# EAGLE design SC (EAGLE 9.4.0)
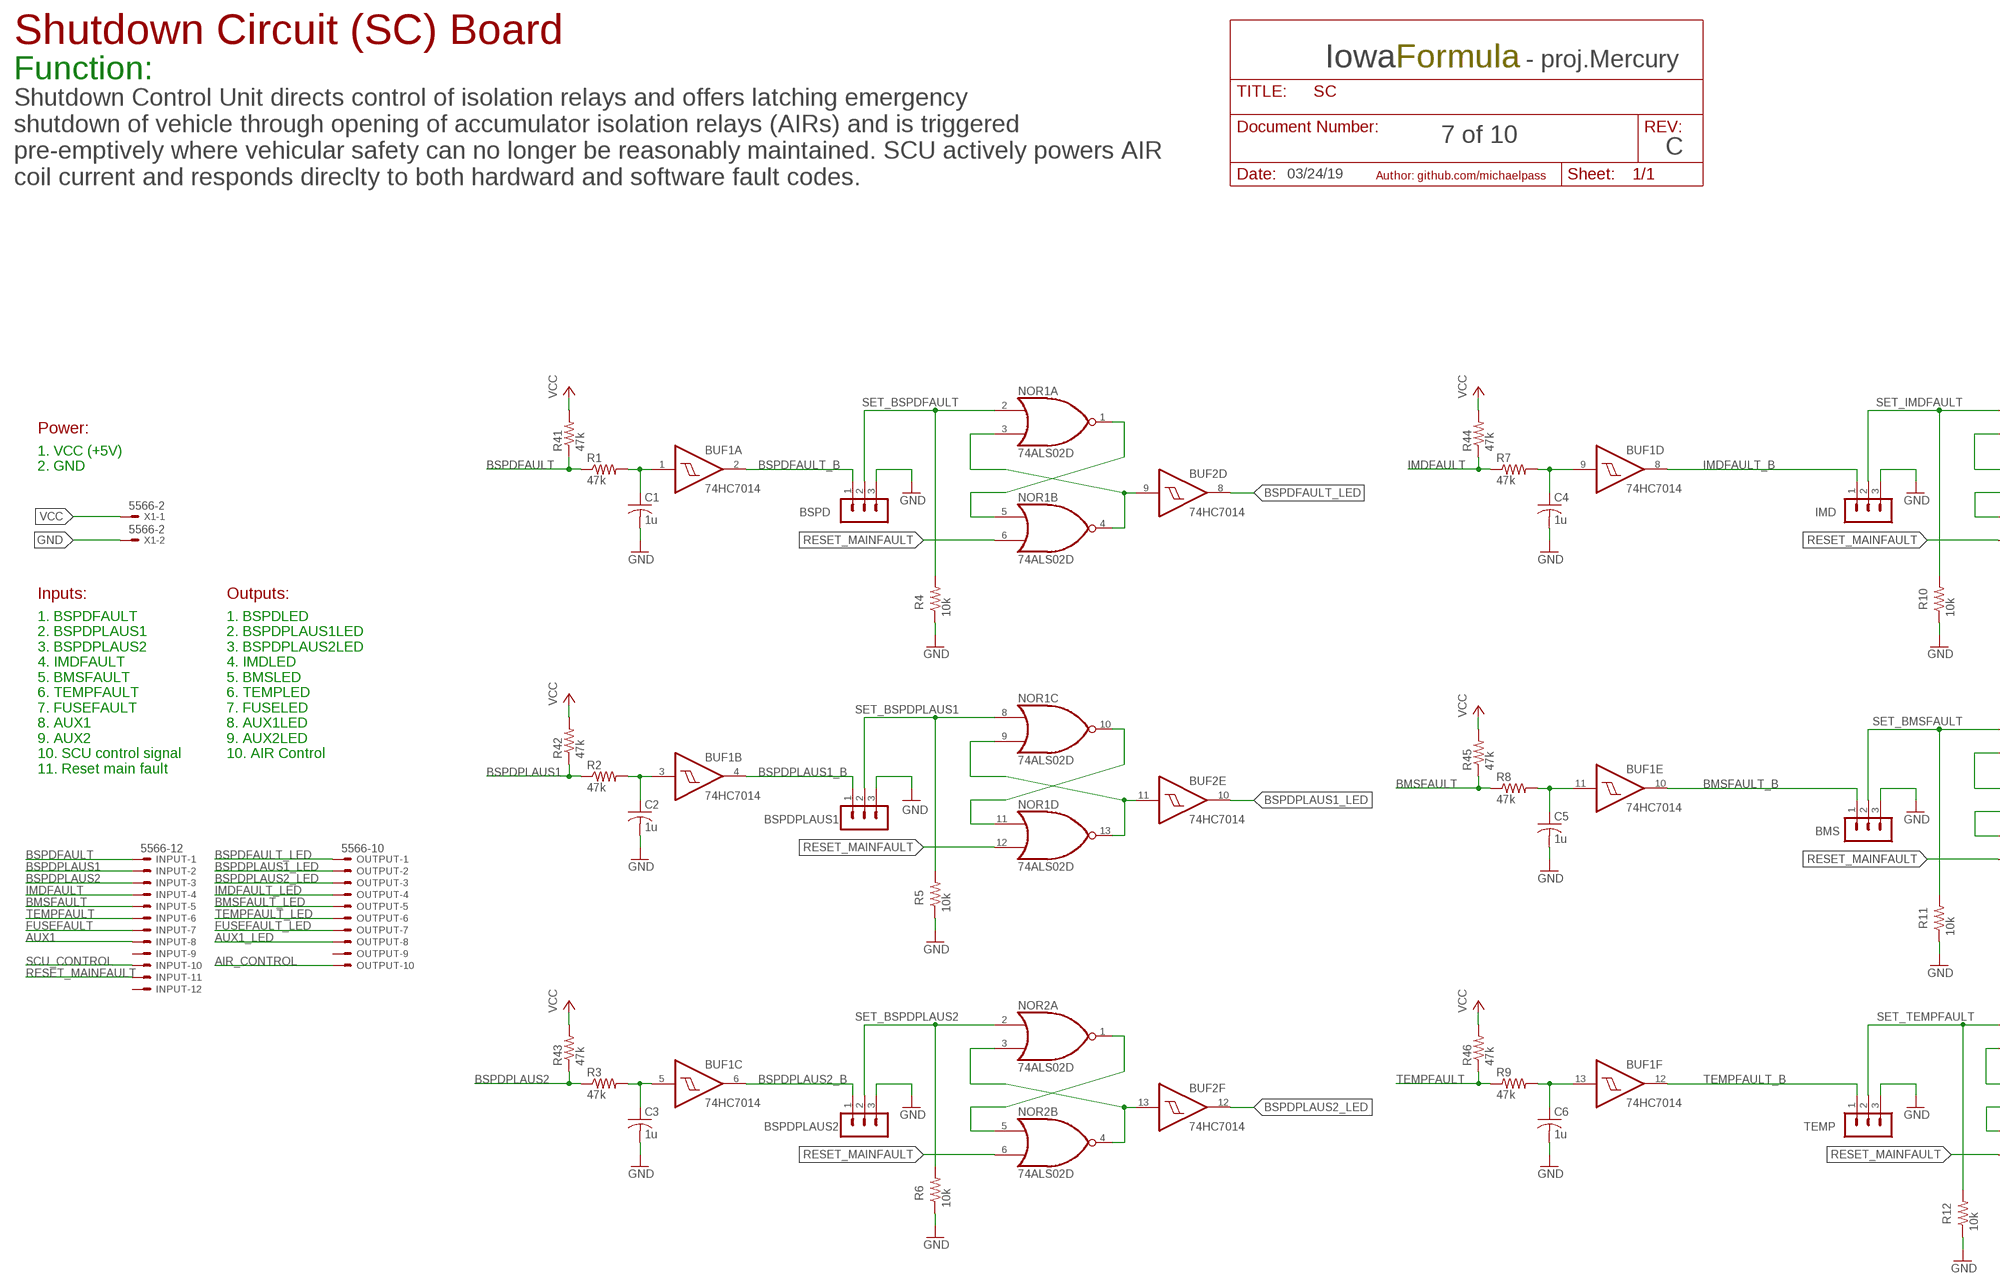
[diagram p0: schematic, sheet 1, part 1 of 3]
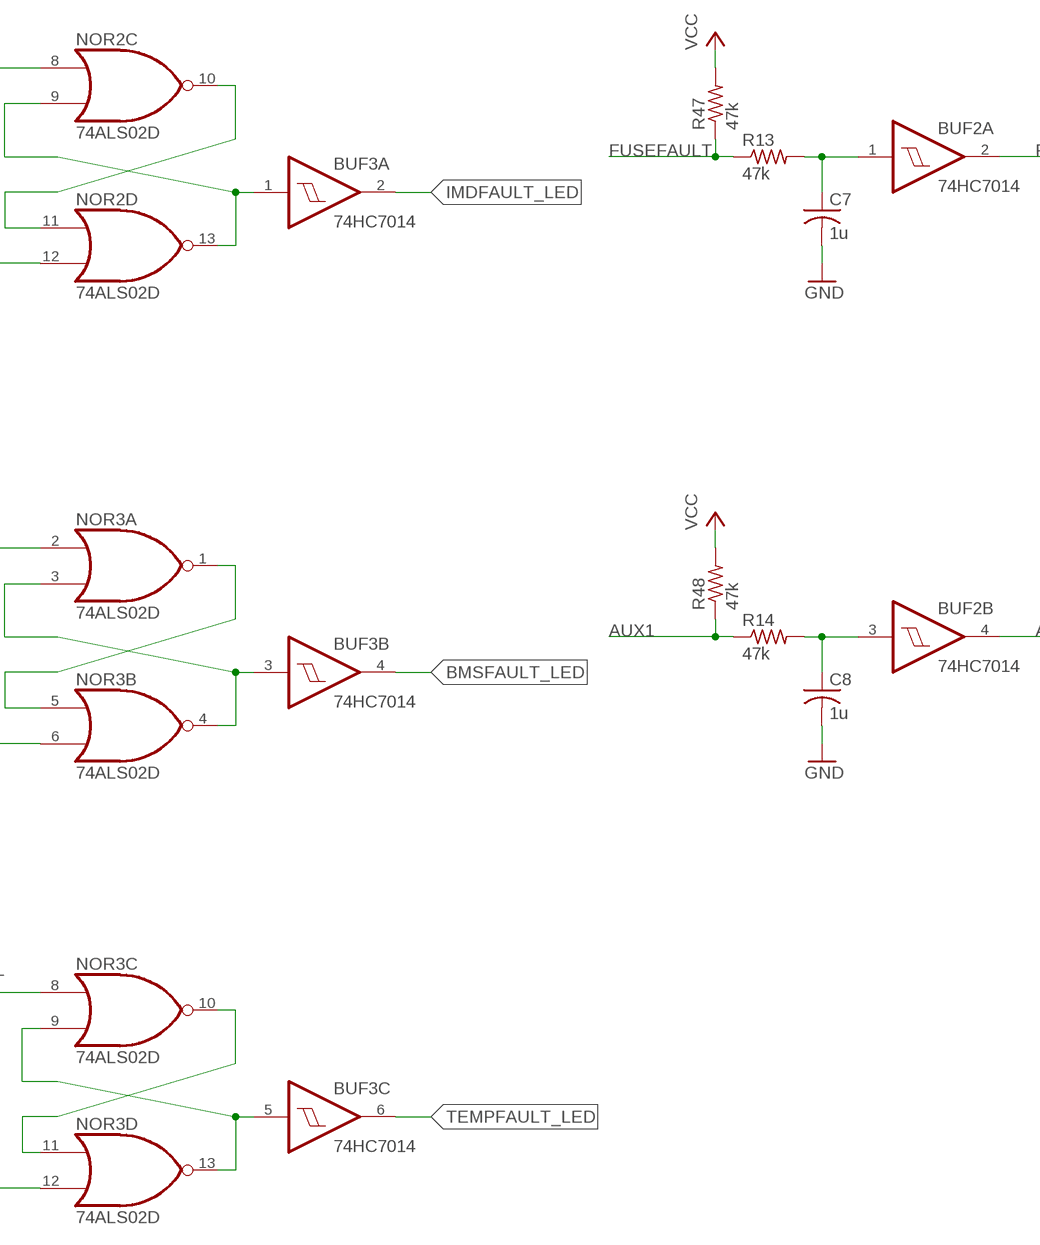
[diagram p1: schematic, sheet 1, part 2 of 3]
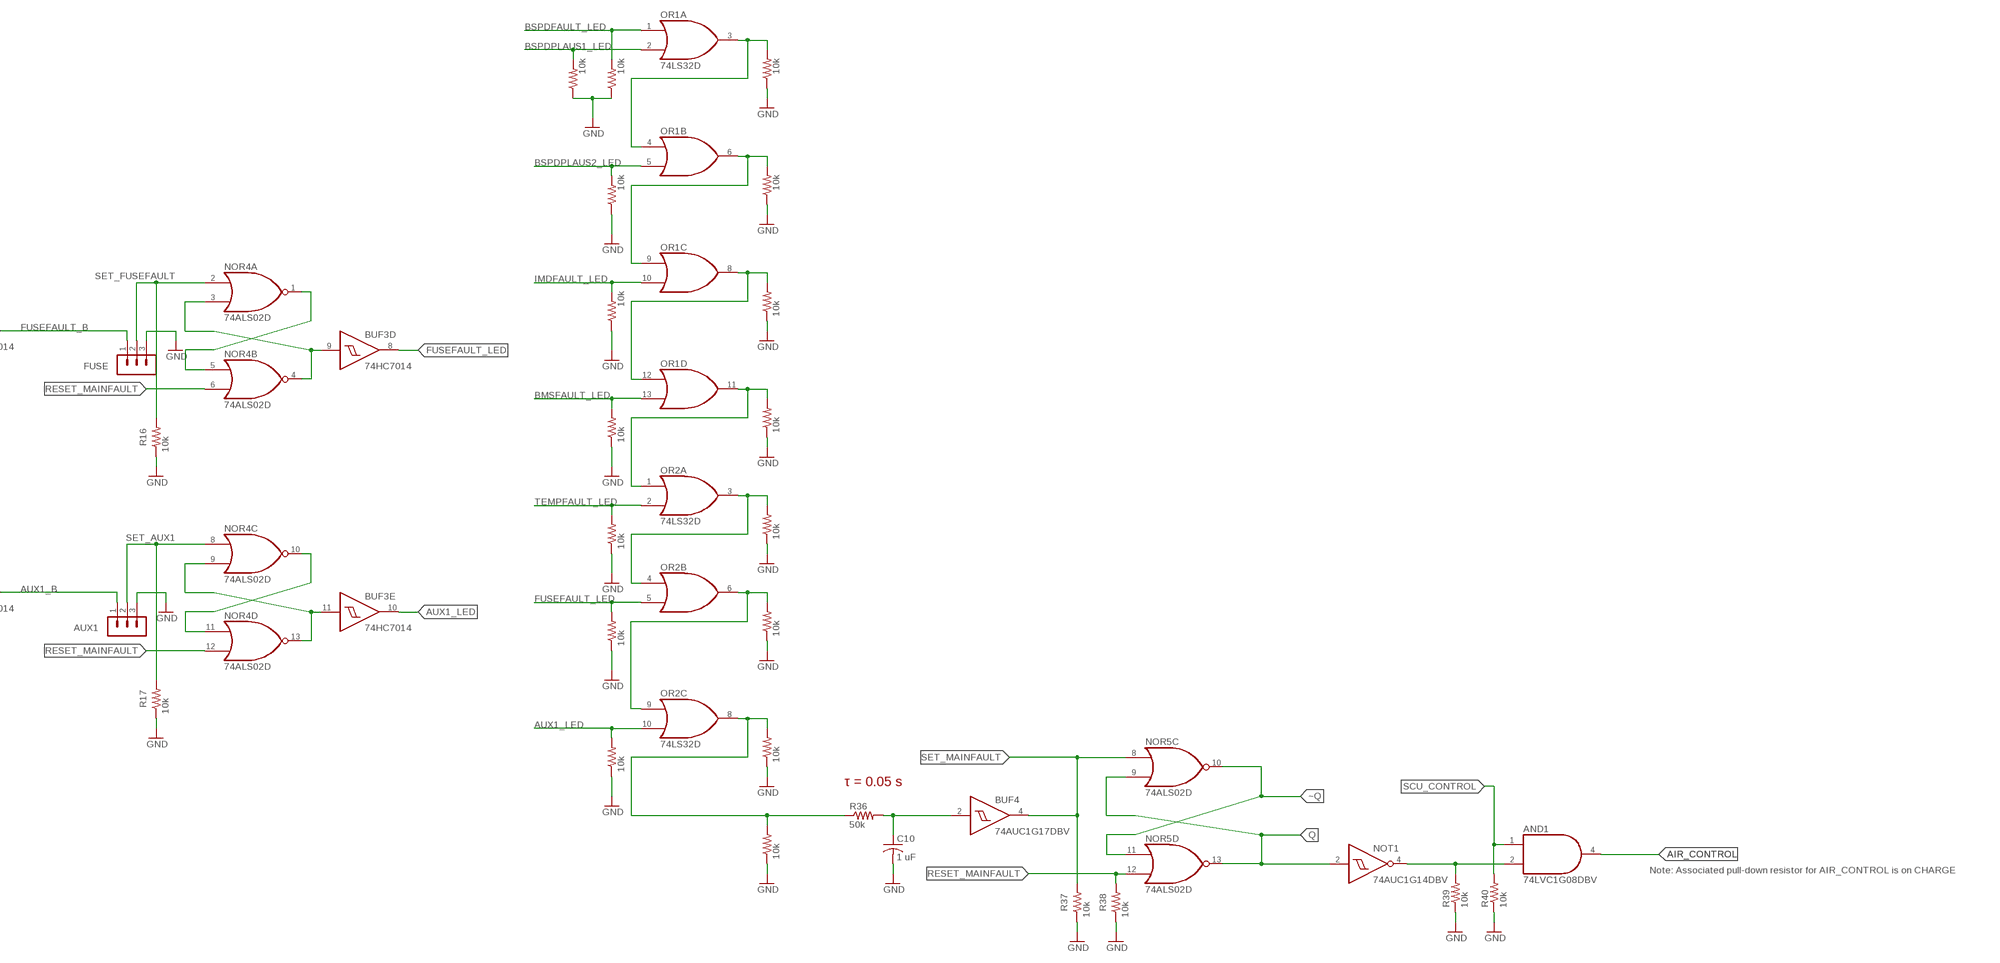
[diagram p2: schematic, sheet 1, part 3 of 3]

## Parts
AND1  74LVC1G08DBV  [SOT23-5]
AUX1  MA03-1  [MA03-1]
BMS  MA03-1  [MA03-1]
BSPD  MA03-1  [MA03-1]
BSPDPLAUS1  MA03-1  [MA03-1]
BSPDPLAUS2  MA03-1  [MA03-1]
BUF1  74HC7014  [SO14]
BUF2  74HC7014  [SO14]
BUF3  74HC7014  [SO14]
BUF4  74AUC1G17DBV  [SOT23-5]
C1  1u  C-USC0805  [C0805]
C2  1u  C-USC0805  [C0805]
C3  1u  C-USC0805  [C0805]
C4  1u  C-USC0805  [C0805]
C5  1u  C-USC0805  [C0805]
C6  1u  C-USC0805  [C0805]
C7  1u  C-USC0805  [C0805]
C8  1u  C-USC0805  [C0805]
C10  1 uF  C-USC0805  [C0805]
FUSE  MA03-1  [MA03-1]
IMD  MA03-1  [MA03-1]
INPUT  5566-12  [5566-12]
NOR1  74ALS02D  [SO14]
NOR2  74ALS02D  [SO14]
NOR3  74ALS02D  [SO14]
NOR4  74ALS02D  [SO14]
NOR5  74ALS02D  [SO14]
NOT1  74AUC1G14DBV  [SOT23-5]
OR1  74LS32D  [SO14]
OR2  74LS32D  [SO14]
OUTPUT  5566-10  [5566-10]
R1  47k  R-US_R0805  [R0805]
R2  47k  R-US_R0805  [R0805]
R3  47k  R-US_R0805  [R0805]
R4  10k  R-US_R0805  [R0805]
R5  10k  R-US_R0805  [R0805]
R6  10k  R-US_R0805  [R0805]
R7  47k  R-US_R0805  [R0805]
R8  47k  R-US_R0805  [R0805]
R9  47k  R-US_R0805  [R0805]
R10  10k  R-US_R0805  [R0805]
R11  10k  R-US_R0805  [R0805]
R12  10k  R-US_R0805  [R0805]
R13  47k  R-US_R0805  [R0805]
R14  47k  R-US_R0805  [R0805]
R16  10k  R-US_R0805  [R0805]
R17  10k  R-US_R0805  [R0805]
R19  10k  R-US_R0805  [R0805]
R20  10k  R-US_R0805  [R0805]
R21  10k  R-US_R0805  [R0805]
R22  10k  R-US_R0805  [R0805]
R23  10k  R-US_R0805  [R0805]
R24  10k  R-US_R0805  [R0805]
R25  10k  R-US_R0805  [R0805]
R26  10k  R-US_R0805  [R0805]
R28  10k  R-US_R0805  [R0805]
R29  10k  R-US_R0805  [R0805]
R30  10k  R-US_R0805  [R0805]
R31  10k  R-US_R0805  [R0805]
R32  10k  R-US_R0805  [R0805]
R33  10k  R-US_R0805  [R0805]
R34  10k  R-US_R0805  [R0805]
R35  10k  R-US_R0805  [R0805]
R36  50k  R-US_R0805  [R0805]
R37  10k  R-US_R0805  [R0805]
R38  10k  R-US_R0805  [R0805]
R39  10k  R-US_R0805  [R0805]
R40  10k  R-US_R0805  [R0805]
R41  47k  R-US_R0805  [R0805]
R42  47k  R-US_R0805  [R0805]
R43  47k  R-US_R0805  [R0805]
R44  47k  R-US_R0805  [R0805]
R45  47k  R-US_R0805  [R0805]
R46  47k  R-US_R0805  [R0805]
R47  47k  R-US_R0805  [R0805]
R48  47k  R-US_R0805  [R0805]
TEMP  MA03-1  [MA03-1]
X1  5566-2  [5566-2]

## Nets
AIR_CONTROL: AND1.4(O) OUTPUT.10
AUX1: INPUT.8 R14.1 R48.1
AUX1_B: AUX1.1 BUF2.4(B:O)
AUX1_LED: BUF3.10(E:O) OR2.10(C:I1) OUTPUT.8 R26.2
BMSFAULT: INPUT.5 R8.1 R45.1
BMSFAULT_B: BMS.1 BUF1.10(E:O)
BMSFAULT_LED: BUF3.4(B:O) OR1.13(D:I1) OUTPUT.5 R23.2
BSPDFAULT: INPUT.1 R1.1 R41.1
BSPDFAULT_B: BSPD.1 BUF1.2(A:O)
BSPDFAULT_LED: BUF2.8(D:O) OR1.1(A:I0) OUTPUT.1 R20.2
BSPDPLAUS1: INPUT.2 R2.1 R42.1
BSPDPLAUS1_B: BSPDPLAUS1.1 BUF1.4(B:O)
BSPDPLAUS1_LED: BUF2.10(E:O) OR1.2(A:I1) OUTPUT.2 R19.2
BSPDPLAUS2: INPUT.3 R3.1 R43.1
BSPDPLAUS2_B: BSPDPLAUS2.1 BUF1.6(C:O)
BSPDPLAUS2_LED: BUF2.12(F:O) OR1.5(B:I1) OUTPUT.3 R21.2
FUSEFAULT: INPUT.7 R13.1 R47.1
FUSEFAULT_B: BUF2.2(A:O) FUSE.1
FUSEFAULT_LED: BUF3.8(D:O) OR2.5(B:I1) OUTPUT.7 R25.2
GND: AUX1.3 BMS.3 BSPD.3 BSPDPLAUS1.3 BSPDPLAUS2.3 C1.2 C2.2 C3.2 C4.2 C5.2 C6.2 C7.2 C8.2 C10.2 FUSE.3 IMD.3 R4.1 R5.1 R6.1 R10.1 R11.1 R12.1 R16.1 R17.1 R19.1 R20.1 R21.1 R22.1 R23.1 R24.1 R25.1 R26.1 R28.1 R29.1 R30.1 R31.1 R32.1 R33.1 R34.1 R35.1 R37.1 R38.1 R39.1 R40.1 TEMP.3 X1.2
IMDFAULT: INPUT.4 R7.1 R44.1
IMDFAULT_B: BUF1.8(D:O) IMD.1
IMDFAULT_LED: BUF3.2(A:O) OR1.10(C:I1) OUTPUT.4 R22.2
N$1: OR2.6(B:O) OR2.9(C:I0) R33.2
N$2: OR2.8(C:O) R34.2 R35.2 R36.1
N$3: OR1.3(A:O) OR1.4(B:I0) R28.2
N$4: BUF1.3(B:I) C2.1 R2.2
N$5: BUF1.5(C:I) C3.1 R3.2
N$6: BUF4.2(I) C10.1 R36.2
N$7: BUF1.9(D:I) C4.1 R7.2
N$8: AND1.2(I1) NOT1.4(O) R39.2
N$9: BUF1.11(E:I) C5.1 R8.2
N$10: BUF1.13(F:I) C6.1 R9.2
N$12: OR1.6(B:O) OR1.9(C:I0) R29.2
N$13: OR1.8(C:O) OR1.12(D:I0) R30.2
N$14: OR1.11(D:O) OR2.1(A:I0) R31.2
N$15: BUF2.1(A:I) C7.1 R13.2
N$16: BUF2.3(B:I) C8.1 R14.2
N$17: OR2.3(A:O) OR2.4(B:I0) R32.2
N$18: BUF1.1(A:I) C1.1 R1.2
Q: NOR5.9(C:I1) NOR5.13(D:O) NOT1.2(I)
Q_AUX1: BUF3.11(E:I) NOR4.9(C:I1) NOR4.13(D:O)
Q_BMSFAULT: BUF3.3(B:I) NOR3.3(A:I1) NOR3.4(B:O)
Q_BSPDFAULT: BUF2.9(D:I) NOR1.3(A:I1) NOR1.4(B:O)
Q_BSPDPLAUS1: BUF2.11(E:I) NOR1.9(C:I1) NOR1.13(D:O)
Q_BSPDPLAUS2: BUF2.13(F:I) NOR2.3(A:I1) NOR2.4(B:O)
Q_FUSEFAULT: BUF3.9(D:I) NOR4.3(A:I1) NOR4.4(B:O)
Q_IMDFAULT: BUF3.1(A:I) NOR2.9(C:I1) NOR2.13(D:O)
Q_TEMPFAULT: BUF3.5(C:I) NOR3.9(C:I1) NOR3.13(D:O)
RESET_MAINFAULT: INPUT.11 NOR1.6(B:I1) NOR1.12(D:I1) NOR2.6(B:I1) NOR2.12(D:I1) NOR3.6(B:I1) NOR3.12(D:I1) NOR4.6(B:I1) NOR4.12(D:I1) NOR5.12(D:I1) R38.2
SCU_CONTROL: AND1.1(I0) INPUT.10 R40.2
SET_AUX1: AUX1.2 NOR4.8(C:I0) R17.2
SET_BMSFAULT: BMS.2 NOR3.2(A:I0) R11.2
SET_BSPDFAULT: BSPD.2 NOR1.2(A:I0) R4.2
SET_BSPDPLAUS1: BSPDPLAUS1.2 NOR1.8(C:I0) R5.2
SET_BSPDPLAUS2: BSPDPLAUS2.2 NOR2.2(A:I0) R6.2
SET_FUSEFAULT: FUSE.2 NOR4.2(A:I0) R16.2
SET_IMDFAULT: IMD.2 NOR2.8(C:I0) R10.2
SET_MAINFAULT: BUF4.4(O) NOR5.8(C:I0) R37.2
SET_TEMPFAULT: NOR3.8(C:I0) R12.2 TEMP.2
TEMPFAULT: INPUT.6 R9.1 R46.1
TEMPFAULT_B: BUF1.12(F:O) TEMP.1
TEMPFAULT_LED: BUF3.6(C:O) OR2.2(A:I1) OUTPUT.6 R24.2
VCC: R41.2 R42.2 R43.2 R44.2 R45.2 R46.2 R47.2 R48.2 X1.1
~Q: NOR5.10(C:O) NOR5.11(D:I0)
~Q_AUX1: NOR4.10(C:O) NOR4.11(D:I0)
~Q_BMSFAULT: NOR3.1(A:O) NOR3.5(B:I0)
~Q_BSPDFAULT: NOR1.1(A:O) NOR1.5(B:I0)
~Q_BSPDPLAUS1: NOR1.10(C:O) NOR1.11(D:I0)
~Q_BSPDPLAUS2: NOR2.1(A:O) NOR2.5(B:I0)
~Q_FUSEFAULT: NOR4.1(A:O) NOR4.5(B:I0)
~Q_IMDFAULT: NOR2.10(C:O) NOR2.11(D:I0)
~Q_TEMPFAULT: NOR3.10(C:O) NOR3.11(D:I0)
Unconnected: BUF2.5(C:I) BUF2.6(C:O) BUF3.12(F:O) BUF3.13(F:I) INPUT.9 INPUT.12 NOR5.1(A:O) NOR5.2(A:I0) NOR5.3(A:I1) NOR5.4(B:O) NOR5.5(B:I0) NOR5.6(B:I1) OR2.11(D:O) OR2.12(D:I0) OR2.13(D:I1) OUTPUT.9

## Notes on the sheet
- Shutdown Circuit (SC) Board
- Iowa | Formula | - proj.Mercury
- Function:
- 7 of 10
- C
- 03/24/19 | Author: github.com/michaelpass
- Shutdown Control Unit directs control of isolation relays and offers latching emergency
  shutdown of vehicle through opening of accumulator isolation relays (AIRs) and is triggered
  pre-emptively where vehicular safety can no longer be reasonably maintained. SCU actively powers AIR
  coil current and responds direclty to both hardward and software fault codes.
- Power:
- 1. VCC (+5V)
  2. GND
- Inputs: | Outputs:
- 1. BSPDFAULT
  2. BSPDPLAUS1
  3. BSPDPLAUS2
  4. IMDFAULT
  5. BMSFAULT
  6. TEMPFAULT
  7. FUSEFAULT
  8. AUX1
  9. AUX2
  10. SCU control signal
  11. Reset main fault
- 1. BSPDLED
  2. BSPDPLAUS1LED
  3. BSPDPLAUS2LED
  4. IMDLED
  5. BMSLED
  6. TEMPLED
  7. FUSELED
  8. AUX1LED
  9. AUX2LED
  10. AIR Control
- τ = 0.05 s
- Note: Associated pull-down resistor for AIR_CONTROL is on CHARGE

## Power pins joined to a net without a drawn wire
GND: AND1.3(GND) BUF1.7(P:GND) BUF2.7(P:GND) BUF3.7(P:GND) BUF4.3(GND) NOR1.7(P:GND) NOR2.7(P:GND) NOR3.7(P:GND) NOR4.7(P:GND) NOR5.7(P:GND) NOT1.3(GND) OR1.7(P:GND) OR2.7(P:GND)
VCC: AND1.5(VCC) BUF1.14(P:VCC) BUF2.14(P:VCC) BUF3.14(P:VCC) BUF4.5(VCC) NOR1.14(P:VCC) NOR2.14(P:VCC) NOR3.14(P:VCC) NOR4.14(P:VCC) NOR5.14(P:VCC) NOT1.5(VCC) OR1.14(P:VCC) OR2.14(P:VCC)

## Library data of the parts
AND1 = 74xx-little-us:74*1G08: 2-input AND gate
AUX1 BMS BSPD BSPDPLAUS1 BSPDPLAUS2 FUSE IMD TEMP = con-lstb:MA03-1: PIN HEADER; OC_FARNELL: unknown; OC_NEWARK: unknown
BUF1-BUF3 = IowaFormula:74HC7014: Hex BUFFER, non-inverting Google Drive Datasheet <https://drive.google.com/open?id=1Q57tX700a5tv_NRNsWQVKWHx4dyldkIF>
BUF4 = 74xx-little-us:74*1G17: Single Schmitt-Trigger Buffer
C1-C8 C10 = rcl:C-US: CAPACITOR, American symbol; SPICEPREFIX: C
INPUT = con-molex:5566-12: Mini FIT connector 12 pol Source: http://www.molex.com; MF: MOLEX; OC_FARNELL: unknown; OC_NEWARK: unknown
NOR1-NOR5 = 74xx-us:74*02: Quad 2-input NOR gate
NOT1 = 74xx-little-us:74*1G14: Single Schmitt-Trigger Inverter Gate
OR1 OR2 = 74xx-us:74*32: Quad 2-input OR gate
OUTPUT = con-molex:5566-10: Mini FIT connector 10 pol Source: http://www.molex.com; MF: MOLEX; OC_FARNELL: unknown; OC_NEWARK: unknown
R1-R14 R16 R17 R19-R26 R28-R48 = rcl:R-US_: RESISTOR, American symbol; SPICEPREFIX: R
X1 = con-molex:5566-2: Mini FIT connector 2 pol Source: http://www.molex.com; MF: MOLEX; OC_FARNELL: 1822072; OC_NEWARK: unknown

## Board
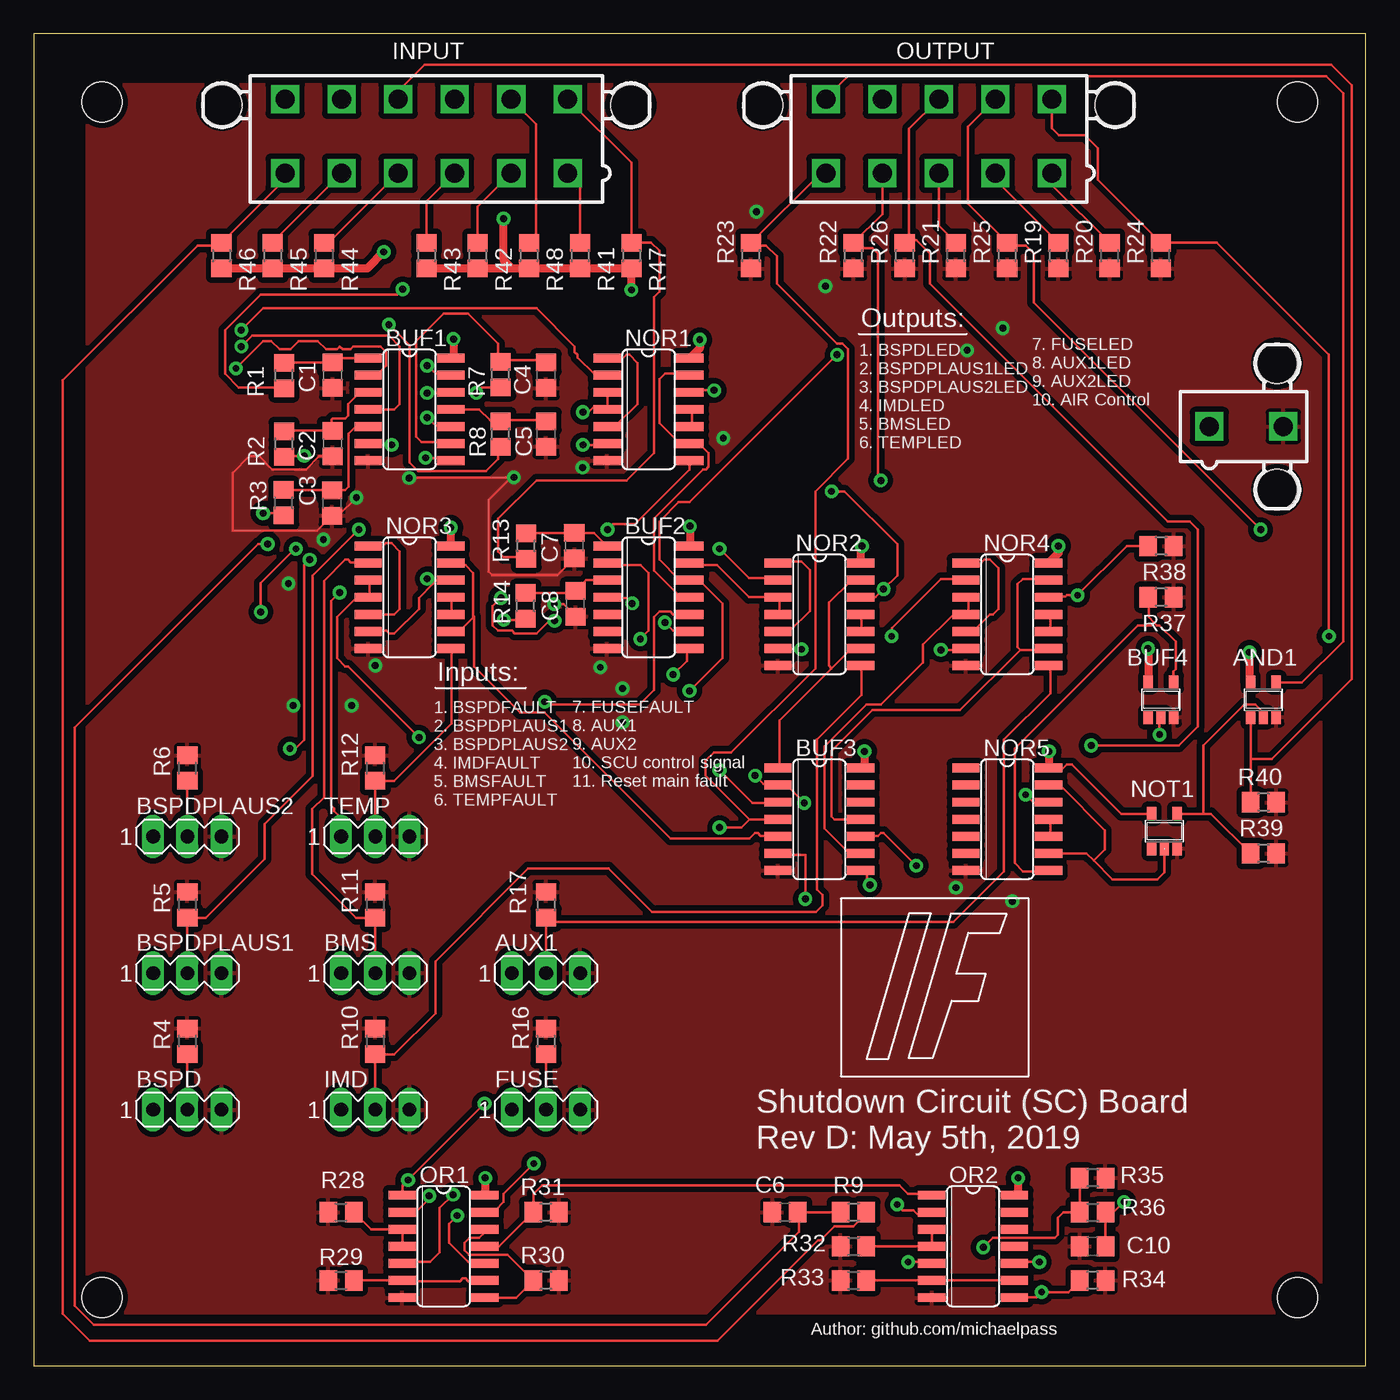
[diagram p3: board, top side]
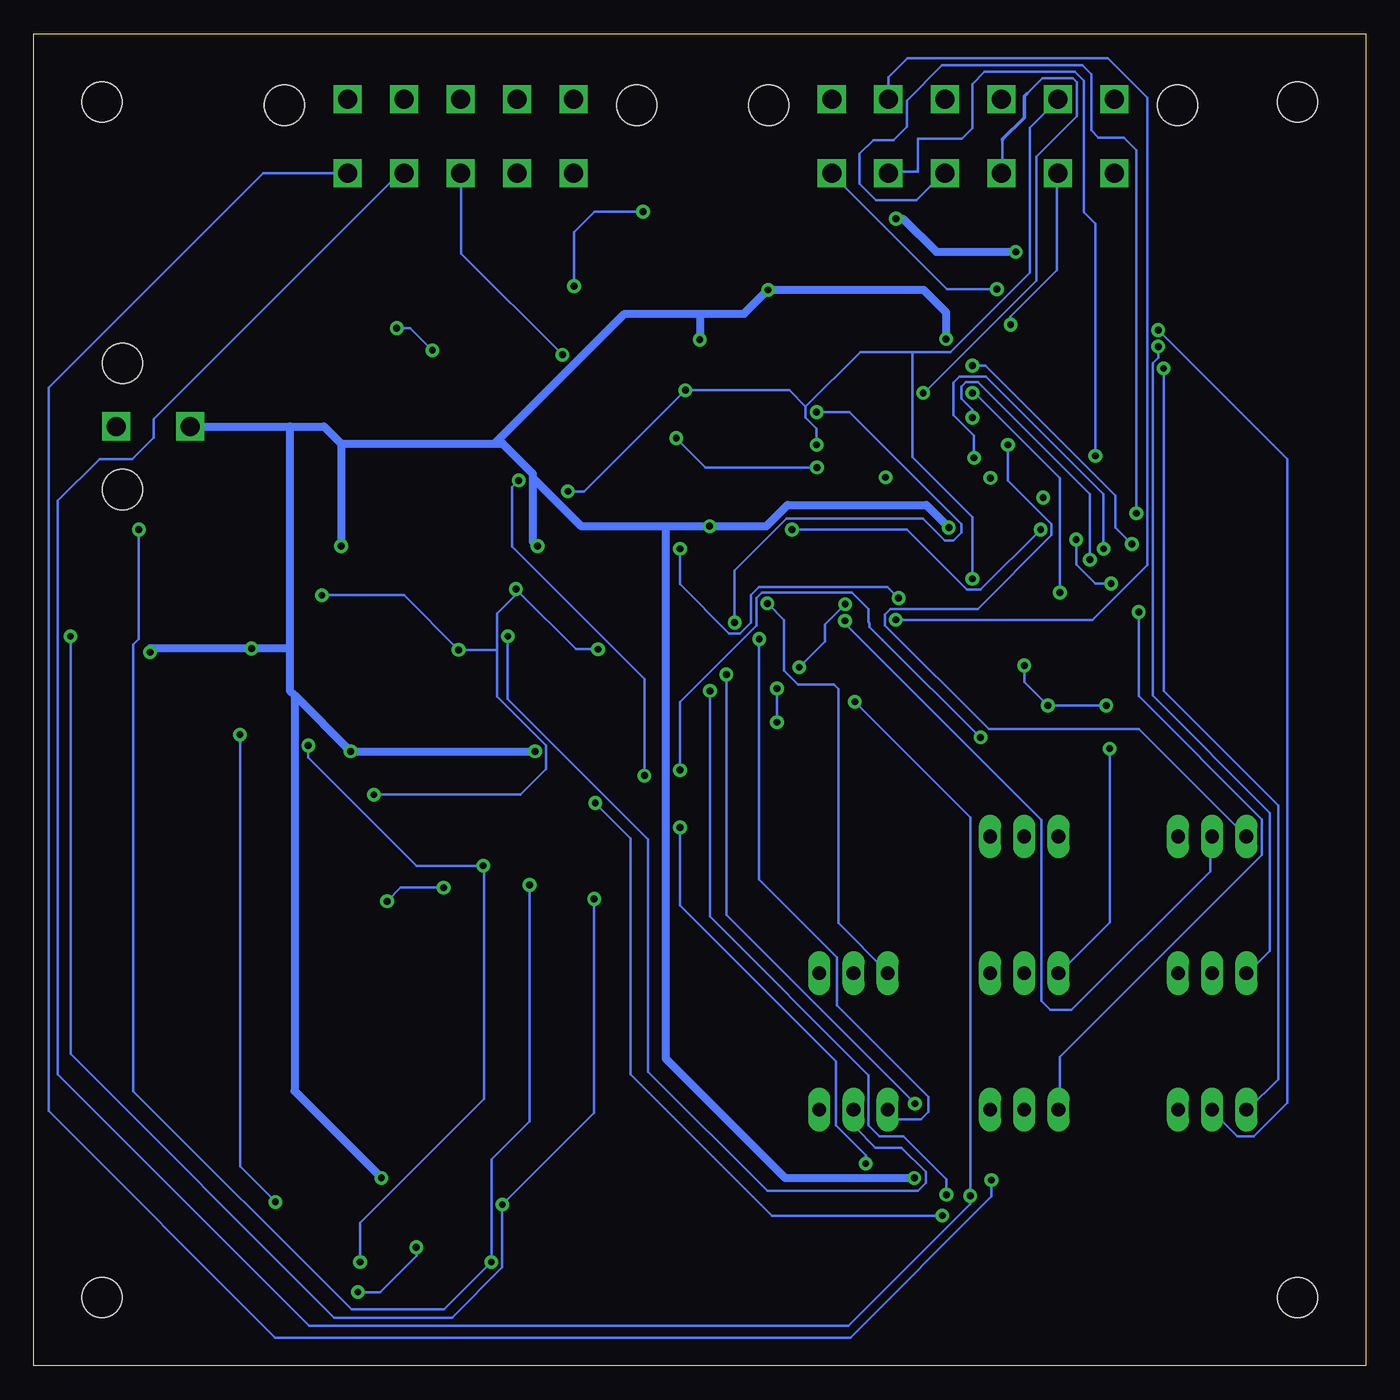
[diagram p4: board, bottom side, seen from below]

Size 99.06 x 99.06 mm. Coordinates in mm from the lower left corner, seen from the top.
Outline: 0,0 99.06,0 99.06,99.06 0,99.06 0,0
Copper layers (1*16): Top 0.035mm / dielectric 1.5mm / Bottom 0.035mm
Design rules "SparkFun *": minimum track width 8mil, minimum drill 20mil, track to track 8mil, track to pad 8mil, pad to pad 8mil, via to via 8mil, smd to smd 8mil, copper to edge 10mil, drill to drill 8mil, minimum pad ring 12mil, minimum via ring 10mil, stop-mask expansion 4mil, vias tented up to drill 25mil, thermal gap 10mil
Holes 3 mm at 93.98,93.98 5.08,93.98 5.08,5.08 93.98,5.08

### Footprints (pad centres in the part's own frame; a part is rotated, then mirrored left to right if it is on the bottom)
SOT23-5 = smd 0.69 x 0.99: 1 -0.95,-1.29; 2 0,-1.29; 3 0.95,-1.29; 4 0.95,1.3; 5 -0.95,1.3
MA03-1 = drill 1.016 long: 1 -2.54,0; 2 0,0; 3 2.54,0
SO14 = smd 0.66 x 2.032: 1 -3.81,-3.073; 2 -2.54,-3.073; 3 -1.27,-3.073; 4 0,-3.073; 5 1.27,-3.073; 6 2.54,-3.073; 7 3.81,-3.073; 8 3.81,3.073; 9 2.54,3.073; 10 1.27,3.073; 11 0,3.073; 12 -1.27,3.073; 13 -2.54,3.073; 14 -3.81,3.073
C0805 = smd 1.3 x 1.5: 1 -0.95,0; 2 0.95,0
5566-12 = drill 1.4 square: 1 10.5,-2.75; 2 6.3,-2.75; 3 2.1,-2.75; 4 -2.1,-2.75; 5 -6.3,-2.75; 6 -10.5,-2.75; 7 10.5,2.75; 8 6.3,2.75; 9 2.1,2.75; 10 -2.1,2.75; 11 -6.3,2.75; 12 -10.5,2.75 | hole 3: 15.2,2.29; -15.2,2.29
5566-10 = drill 1.4 square: 1 8.4,-2.75; 2 4.2,-2.75; 3 0,-2.75; 4 -4.2,-2.75; 5 -8.4,-2.75; 6 8.4,2.75; 7 4.2,2.75; 8 0,2.75; 9 -4.2,2.75; 10 -8.4,2.75 | hole 3: 13.1,2.29; -13.1,2.29
R0805 = smd 1.3 x 1.5: 1 -0.95,0; 2 0.95,0
5566-2 = drill 1.4 square: 1 0,-2.75; 2 0,2.75 | hole 3: 4.7,2.29; -4.7,2.29

### Placement (x,y rotation side)
AND1  91.44,49.53 0 top
AUX1  38.1,29.21 0 top
BMS  25.4,29.21 0 top
BSPD  11.43,19.05 0 top
BSPDPLAUS1  11.43,29.21 0 top
BSPDPLAUS2  11.43,39.37 0 top
BUF1  27.94,71.12 270 top
BUF2  45.72,57.15 270 top
BUF3  58.42,40.64 270 top
BUF4  83.82,49.53 0 top
C1  22.23,73.66 270 top
C2  22.23,68.58 270 top
C3  22.2,64.16 270 top
C4  38.1,73.66 270 top
C5  38.1,69.29 270 top
C6  55.88,11.43 180 top
C7  40.21,60.99 270 top
C8  40.28,56.67 270 top
C10  78.74,8.89 180 top
FUSE  38.1,19.05 0 top
IMD  25.4,19.05 0 top
INPUT  29.21,91.44 0 top
NOR1  45.72,71.12 270 top
NOR2  58.42,55.88 270 top
NOR3  27.94,57.15 270 top
NOR4  72.39,55.88 270 top
NOR5  72.39,40.64 270 top
NOT1  84.07,39.75 0 top
OR1  30.48,8.89 270 top
OR2  69.85,8.89 270 top
OUTPUT  67.31,91.44 0 top
R1  18.62,73.63 90 top
R2  18.62,68.55 90 top
R3  18.59,64.19 90 top
R4  11.43,24.13 270 top
R5  11.43,34.29 270 top
R6  11.43,44.45 270 top
R7  34.72,73.71 90 top
R8  34.72,69.29 90 top
R9  60.96,11.43 180 top
R10  25.4,24.13 270 top
R11  25.4,34.29 270 top
R12  25.4,44.45 270 top
R13  36.63,60.96 90 top
R14  36.58,56.52 90 top
R16  38.1,24.13 270 top
R17  38.1,34.29 270 top
R19  76.2,82.55 90 top
R20  80.01,82.55 90 top
R21  68.58,82.55 90 top
R22  60.96,82.55 90 top
R23  53.34,82.55 90 top
R24  83.82,82.55 90 top
R25  72.39,82.55 90 top
R26  64.77,82.55 90 top
R28  22.86,11.43 0 top
R29  22.86,6.35 0 top
R30  38.1,6.35 180 top
R31  38.1,11.43 180 top
R32  60.96,8.89 0 top
R33  60.96,6.35 0 top
R34  78.74,6.35 180 top
R35  78.74,13.97 180 top
R36  78.74,11.43 0 top
R37  83.82,57.15 180 top
R38  83.82,60.96 180 top
R39  91.44,38.1 180 top
R40  91.44,41.91 180 top
R41  40.64,82.55 270 top
R42  33.02,82.55 270 top
R43  29.21,82.55 270 top
R44  21.59,82.55 270 top
R45  17.78,82.55 270 top
R46  13.97,82.55 270 top
R47  44.45,82.55 270 top
R48  36.83,82.55 270 top
TEMP  25.4,39.37 0 top
X1  90.17,69.85 270 top

### Tracks (layer width: path | path; a pad name or v marks a point on that pad's centre or on a via)
AIR_CONTROL
  Top 0.203: AND1.4 92.46,50.8 94.31,50.8 97.38,53.87 97.38,94.64 96.11,95.91 60.55,95.91 58.93,94.28 OUTPUT.10
AUX1  (via drill 0.51)
  Top 0.203: R48.1 37.37,84.04 37.37,92.33 INPUT.8 | v34.95,55.47 36.58,55.47 R14.1
  Bottom 0.203: v34.95,55.47 20.34,55.47 16.26,59.56 16.26,94.28 19.2,97.23 34.09,97.23 35.51,95.81 INPUT.8
AUX1_B  (via drill 0.51)
  Top 0.203: v44.5,56.69 44.09,57.1 42.67,57.1 BUF2.4
  Bottom 0.203: v44.5,56.69 44.48,56.69 43.26,55.47 43.26,51.69 42.24,50.67 39.55,50.67 39.22,50.34 39.22,32.92 35.56,29.26 AUX1.1
AUX1_LED  (via drill 0.51)
  Top 0.203: OUTPUT.8 65.1,91.98 65.1,83.83 R26.2 65.02,83.72 65.63,83.72 66.65,82.7 66.65,80.47 84.33,62.79 85.95,62.79 86.56,62.18 86.56,47.55 85.14,46.13 v78.64,46.13 | v74.78,7.72 72.95,7.72 OR2.10 | v65.63,37.19 63.2,39.62 62.99,39.62 62.79,39.42 61.57,39.42 BUF3.10
  Bottom 0.203: v74.78,7.72 74.78,10.64 65.58,19.84 65.58,37.13 v65.63,37.19 70.59,37.19 78.64,45.24 v78.64,46.13
BMSFAULT  (via drill 0.51)
  Top 0.203: INPUT.5 17.78,83.56 R45.1 | v26.42,77.42 27.94,75.89 27.94,67.16 28.57,66.52 33.65,66.52 34.54,67.42 34.54,68.28 R8.1
  Bottom 0.203: v26.42,77.42 26.42,78.03 22.96,81.48 22.96,88.59 INPUT.5
BMSFAULT_B  (via drill 0.51)
  Top 0.203: v29.26,70.51 29.87,69.9 30.89,69.9 BUF1.10 | v20.52,59.94 20.12,59.54 20.12,46.53 19.48,45.9 v19.05,45.9
  Bottom 0.203: v29.26,70.51 29.26,71.12 30.07,71.93 30.07,72.82 29.74,73.15 28.85,73.15 20.52,64.82 v20.52,59.94 | v19.05,45.9 19.05,32.97 22.76,29.26 BMS.1
BMSFAULT_LED  (via drill 0.51)
  Top 0.203: OUTPUT.5 58.53,88.69 R23.2 53.65,83.72 54.05,83.31 54.46,83.31 55.27,82.5 55.27,80.47 59.74,76 60.15,76 60.55,75.59 60.55,67.46 58.12,65.02 58.12,51.87 51.87,45.62 50.57,45.62 49.96,45.01 49.96,43.92 53.24,40.64 | v37.19,15.04 34.95,12.8 34.95,12.19 34.34,11.58 33.73,11.58 OR1.13 | v51,40.03 52.63,40.03 53.24,40.64 | BUF3.4 53.24,40.64
  Bottom 0.203: v37.19,15.04 37.19,15.65 39.42,17.88 39.42,22.66 51,34.24 v51,40.03
BSPDFAULT  (via drill 0.51)
  Top 0.203: INPUT.1 40.64,87.76 R41.1 | v27.43,80.06 27.03,79.65 16.87,79.65 14.22,77.01 14.22,73.76 15.24,72.75 18.49,72.75 R1.1
  Bottom 0.203: v27.43,80.06 31.17,80.06 38.88,87.77 INPUT.1
BSPDFAULT_B  (via drill 0.51)
  Top 0.203: v15.04,74.17 17.07,76.2 17.68,76.2 18.29,75.59 19.1,75.59 19.71,76.2 21.13,76.2 21.74,75.59 22.55,75.59 22.76,75.79 22.96,75.59 23.57,75.59 23.77,75.79 25.81,75.79 26.21,75.39 26.21,74.37 25.6,73.76 24.99,73.76 BUF1.2
  Bottom 0.203: v15.04,74.17 15.04,50.16 6.53,41.66 6.53,21.31 8.74,19.1 BSPD.1
BSPDFAULT_LED  (via drill 0.51)
  Top 0.203: R20.2 75.71,87.8 OUTPUT.1 | v33.53,19.51 v27.84,13.82 27.43,13.41 27.43,12.8 OR1.1 | v47.55,51.41 48.56,52.43 48.56,53.24 48.77,53.44 BUF2.8
  Bottom 0.203: v33.53,19.51 47.55,33.53 v47.55,51.41 | OUTPUT.1 82,88.69 97.94,72.75 97.94,18.95 81.1,2.11 38.33,2.11 27.84,12.6 v27.84,13.82
BSPDPLAUS1  (via drill 0.51)
  Top 0.203: INPUT.2 33.02,86.2 R42.1 | v20.12,67.67 18.69,67.67 R2.1
  Bottom 0.203: v20.12,67.67 20.12,84.91 20.98,85.78 20.98,95.56 21.64,96.22 28.35,96.22 29.26,95.3 29.26,92.02 30.02,91.26 33.33,91.26 33.33,88.8 35.36,88.8 INPUT.2
BSPDPLAUS1_B  (via drill 0.51)
  Top 0.203: BUF1.4 26.82,71.12 27.23,71.53 27.23,75.79 26.42,76.61 16.26,76.61 v15.44,75.79
  Bottom 0.203: v15.44,75.79 15.44,74.98 15.85,74.57 15.85,49.84 7.14,41.12 7.14,30.86 8.74,29.26 BSPDPLAUS1.1
BSPDPLAUS1_LED  (via drill 0.51)
  Top 0.203: R19.2 71.51,88.19 OUTPUT.2 | v29.41,12.65 29.41,12.42 28.45,11.46 27.41,11.46 OR1.2 | v38,49.38 38.2,49.17 45.06,49.17 46.13,50.24 46.13,55.68 46.53,56.08 47.35,56.08 47.55,55.88 BUF2.10
  Bottom 0.203: v38,49.38 29.41,40.79 v29.41,12.65 29.41,12.04 38.46,3 78.59,3 97.26,21.67 97.26,64.34 94.16,67.44 91.75,67.44 90.14,69.04 90.14,70.38 71.93,88.59 71.53,88.59 OUTPUT.2
BSPDPLAUS2  (via drill 0.51)
  Top 0.203: INPUT.3 29.21,86.59 R43.1 | v17.07,63.4 18.49,63.4 R3.1
  Bottom 0.203: v17.07,63.4 17.07,90.4 18.01,91.34 19.89,91.34 20.42,91.87 20.42,96.04 21.08,96.7 31.52,96.7 34.14,94.08 34.14,92.13 35.13,91.14 36.63,91.14 37.64,90.12 37.64,87.91 36.42,86.69 33.4,86.69 31.5,88.59 INPUT.3
BSPDPLAUS2_B  (via drill 0.51)
  Top 0.203: v26.62,68.48 24.99,68.48 BUF1.6
  Bottom 0.203: v26.62,68.48 26.62,65.84 23.37,62.59 23.37,61.77 28.85,56.29 35.36,56.29 35.76,55.88 35.76,55.07 28.04,47.35 16.87,47.35 BSPDPLAUS2.1
BSPDPLAUS2_LED  (via drill 0.51)
  Top 0.203: R21.2 67.31,84.77 OUTPUT.3 | v31.19,12.72 30.2,11.73 30.2,8.46 29.46,7.72 27.43,7.72 OR1.5 | v48.77,50.19 51.21,52.63 51.21,56.69 49.58,58.32 48.97,58.32 BUF2.12 48.77,58.52 47.95,58.52 46.53,59.94 46.53,62.79 47.95,64.21 48.77,64.21 v59.74,75.18
  Bottom 0.203: v31.19,12.72 31.19,13.87 34.39,17.07 36.17,17.07 36.98,17.88 36.98,21.61 48.77,33.4 v48.77,50.19 | v59.74,75.18 67.26,82.7 67.26,88.59 OUTPUT.3
FUSEFAULT
  Top 0.203: INPUT.7 44.45,89.45 R47.1 44.5,83.52 45.92,83.52 46.53,82.91 46.53,79.86 46.13,79.45 46.13,67.87 44.09,65.84 37.39,65.84 34.54,62.99 34.54,60.55 34.95,60.15 36.58,60.15 R13.1
FUSEFAULT_B  (via drill 0.51)
  Top 0.203: v45.11,54.05 45.72,54.66 45.72,58.95 45.14,59.54 42.67,59.54 BUF2.2
  Bottom 0.203: v45.11,54.05 45.11,36.17 39.32,30.38 39.32,26.8 32.54,20.02 32.54,18.87 33.07,18.34 35,18.34 35.56,18.9 FUSE.1
FUSEFAULT_LED  (via drill 0.51)
  Top 0.203: OUTPUT.7 69.47,92.15 69.47,86.42 R25.2 72.54,83.31 73.76,83.31 74.37,82.7 74.37,79.05 v91.24,62.18 | v65.02,7.72 66.65,7.72 OR2.5 | v62.18,35.76 61.98,35.97 61.98,36.58 61.57,36.98 BUF3.8
  Bottom 0.203: v62.18,35.76 62.18,18.19 65.02,15.34 v65.02,7.72 68.56,4.19 75.41,4.19 91.64,20.42 91.64,53.65 91.24,54.05 v91.24,62.18
GND  (via drill 0.51)
  Top 0.203: C8.2 40.28,55.75 39.4,56.64 v38.71,56.64 | C7.2 38.97,58.8 34.09,58.8 33.83,59.05 33.83,64.39 35.51,66.06 v35.71,66.06 27.96,66.06 v27.92,66.02 | v24,64.57 22.65,63.21 C3.2 21.09,62.1 14.81,62.1 14.81,66.4 16.04,67.63 16.76,67.63 17.74,66.65 20.25,66.65 21.23,67.63 C2.2
  Bottom 0.203: v42.14,51.94 40.21,53.87 40.21,55.14 v38.71,56.64 | v19.3,49.1 v23.65,49.1 25.4,50.85 v25.4,52.07 | v69.42,75.51 71.07,77.17 v72.06,77.17 | v53.75,85.83 57.35,85.83 58.88,84.3 v58.88,80.29 | v51.28,68.99 49.1,66.8 v40.82,66.8 | v68.58,35.56 71.75,35.56 v72.77,34.54 | v21.54,61.44 21.54,59.59 20.12,58.17 v18.95,58.17 | v43.79,50.37 v43.79,47.85
  pour Top (isolate 0.406): 4.04,95.25 95.66,95.25 95.66,3.96 4.04,3.96
IMDFAULT  (via drill 0.51)
  Top 0.203: INPUT.4 21.92,83.5 R44.1 | v32.92,72.34 33.33,72.75 34.54,72.75 R7.1
  Bottom 0.203: v32.92,72.34 32.69,72.57 32.64,72.57 24.51,80.7 24.51,89.89 21.49,92.91 21.49,95.45 21.79,95.76 24.05,95.76 25.21,94.61 | 27.03,91.14 27.03,88.8 INPUT.4
  Bottom 0.254: 25.21,94.61 25.4,94.41 25.4,92.83 27.03,91.2 27.03,91.14
IMDFAULT_B  (via drill 0.51)
  Top 0.203: BUF1.8 30.81,67.51 v29.13,67.51 | v19.51,60.76 19.46,60.76 16.89,58.19 v16.89,56.06
  Bottom 0.203: v29.13,67.51 29.13,69.16 30.66,70.69 30.66,73.13 30.23,73.56 28.25,73.56 19.51,64.82 v19.51,60.76 | v16.89,56.06 16.89,49.81 7.72,40.64 7.72,38 22.76,22.96 22.76,19.1 IMD.1
IMDFAULT_LED  (via drill 0.51)
  Top 0.203: OUTPUT.4 63.11,85.65 R22.2 61.16,83.72 61.77,83.11 62.38,83.11 62.79,82.7 62.79,66.04 v62.99,65.84 | v31.5,11.18 30.89,10.57 30.89,9.14 32.31,7.72 33.53,7.72 OR1.10 | v57.3,41.86 56.08,43.08 55.47,43.08 BUF3.2 55.27,43.28 54.25,43.28 v53.65,43.89
  Bottom 0.203: v31.5,11.18 44.15,11.18 54.66,21.69 54.66,39.22 v57.3,41.86 | v62.99,65.84 63.5,65.33 63.5,60.91 53.65,51.05 v53.65,43.89
N$1
  Top 0.203: R33.2 OR2.6 OR2.9
N$2  (via drill 0.51)
  Top 0.203: OR2.8 72.95,5.11 74.57,5.11 v74.95,5.49 76.93,5.49 R34.2 | R35.2 R36.1 76.58,11.43 76.15,11 76.15,9.73 75.95,9.53 71.32,9.53 v70.61,8.81
  Bottom 0.203: v70.61,8.81 70.59,8.79 70.59,8.18 73.28,5.49 v74.95,5.49
N$3
  Top 0.203: R28.2 25.08,10.16 OR1.3 27.43,10.16 27.43,8.94 OR1.4
N$4
  Top 0.203: R2.2 18.64,69.53 C2.1 22.17,69.58 22.17,70.36 22.25,70.43 23.16,70.43 23.39,70.66 23.39,71.5 24.28,72.39 BUF1.3
N$5
  Top 0.203: R3.2 22.17,65.14 C3.1 23.16,65.11 23.42,65.36 23.42,69.32 23.93,69.83 24.84,69.83 BUF1.5
N$6  (via drill 0.51)
  Top 0.203: C10.1 R36.2 79.86,11.38 80.26,11.38 v81.08,12.19 | v83.72,46.94 83.72,48.16 BUF4.2
  Bottom 0.203: v83.72,46.94 83.72,14.83 v81.08,12.19
N$7
  Top 0.203: C4.1 38,74.78 34.75,74.78 R7.2 34.54,74.78 34.54,76 32.31,78.23 30.48,78.23 28.45,76.2 28.45,69.09 28.85,68.68 30.89,68.68 BUF1.9
N$8
  Top 0.203: R39.2 87.54,41.05 86.97,41.05 | 86.97,41.05 NOT1.4 | AND1.2 91.44,48.56 90.83,49.17 90.02,49.17 86.97,46.13 86.97,41.05
N$9
  Top 0.203: C5.1 38,70.31 34.75,70.31 R8.2 34.54,70.31 33.93,70.31 33.12,71.12 BUF1.11
N$10  (via drill 0.51)
  Top 0.203: R9.2 C6.1 56.9,11.38 56.9,9.96 49.99,3.05 4.47,3.05 3.05,4.47 3.05,47.47 16.69,61.11 v17.4,61.11 | v29.26,74.37 29.87,73.76 30.89,73.76 BUF1.13
  Bottom 0.203: v29.26,74.37 28.3,74.37 18.62,64.69 18.62,62.33 v17.4,61.11
N$12
  Top 0.203: R29.2 OR1.6 27.43,6.3 31.7,6.3 31.9,6.5 32.11,6.5 32.31,6.3 33.53,6.3 OR1.9
N$13
  Top 0.203: OR1.8 35.88,5.08 R30.2 35.24,8.26 32.39,8.26 32.05,8.59 32.05,9.17 32.41,9.53 33.13,9.53 33.55,9.95 OR1.12
N$14
  Top 0.203: OR1.11 34.61,8.89 R31.2 37.19,11.58 37.19,12.8 37.8,13.41 64.39,13.41 65,12.8 66.65,12.8 OR2.1
N$15
  Top 0.203: BUF2.1 41.67,61.94 C7.1 40.18,61.91 R13.2
N$16
  Top 0.203: R14.2 40.13,57.47 C8.1 41.09,58.42 BUF2.3
N$17
  Top 0.203: R32.2 OR2.4 OR2.3
N$18
  Top 0.203: R1.2 18.64,74.61 C1.1 22.55,74.93 BUF1.1
Q
  Top 0.203: NOT1.2 84.07,36.7 83.54,36.17 80.21,36.17 78.82,37.57 | 78.82,37.57 78.28,38.1 NOR5.9 | 78.82,37.57 79.65,38.41 79.65,39.83 76.4,43.08 75.59,43.08 NOR5.13
Q_AUX1
  Top 0.203: BUF3.11 59.54,40.64 59.33,40.84 59.33,45.72 62.38,48.77 68.89,48.77 73.36,53.24 | 73.36,53.24 75.39,53.24 NOR4.9 | 73.36,53.24 73.15,53.44 73.15,58.12 73.56,58.52 75.39,58.52 NOR4.13
Q_BMSFAULT  (via drill 0.51)
  Top 0.203: NOR3.3 24.99,58.32 24.99,57.3 NOR3.4 24.79,57.1 23.98,57.1 22.55,55.68 22.55,52.63 23.16,52.02 23.37,52.02 v28.65,46.74 | v51,44.3 53.44,41.86 55.27,41.86 BUF3.3
  Bottom 0.203: v51,44.3 51,49.38 45.31,55.07 45.31,57.1 44.91,57.51 38.2,57.51 36.98,56.29 36.98,55.3 36.91,55.22 36.91,54.94 35.94,53.98 v28.65,46.74
Q_BSPDFAULT  (via drill 0.51)
  Top 0.203: v46.94,55.27 47.55,54.66 48.77,54.66 BUF2.9 | v40.84,70.92 41.25,70.92 41.66,71.32 42.27,71.32 42.47,71.12 NOR1.4 42.67,71.12 42.67,72.34 NOR1.3
  Bottom 0.203: v46.94,55.27 46.94,59.13 43.08,62.99 32.92,62.99 31.29,61.37 30.68,61.37 30.07,61.98 30.07,62.59 38.41,70.92 v40.84,70.92
Q_BSPDPLAUS1
  Top 0.203: BUF2.11 48.77,57.3 47.95,57.3 46.13,59.13 46.13,62.99 49.78,66.65 49.99,66.65 50.19,66.85 50.19,67.87 49.58,68.48 48.97,68.48 NOR1.9 48.77,68.68 47.95,68.68 46.53,70.1 46.53,73.36 46.94,73.76 48.77,73.76 NOR1.13
Q_BSPDPLAUS2
  Top 0.203: NOR2.4 55.47,55.93 55.47,57.15 NOR2.3 53.19,57.15 50.8,59.54 48.97,59.54 BUF2.13
Q_FUSEFAULT
  Top 0.203: BUF3.9 61.37,38.2 60.55,38.2 58.8,39.95 58.8,46.05 61.92,49.17 62.99,49.17 66.12,52.3 66.12,53.62 68.38,55.88 NOR4.4 69.49,55.88 69.49,57.1 NOR4.3
Q_IMDFAULT
  Top 0.203: 59.33,51.87 60.76,53.29 61.37,53.29 NOR2.9 | 59.33,51.87 55.47,48.01 55.47,44.5 BUF3.1 | 59.33,51.87 59.13,52.07 59.13,56.74 60.76,58.37 61.37,58.37 NOR2.13
Q_TEMPFAULT
  Top 0.203: 32.69,55.65 32.74,55.7 32.74,51.99 36.17,48.56 38,48.56 47.35,39.22 53.24,39.22 53.65,39.62 53.85,39.62 54.05,39.42 55.27,39.42 BUF3.5 | 32.69,55.65 31.7,54.66 31.09,54.66 NOR3.9 | 32.69,55.65 32.69,58.95 32.11,59.54 31.09,59.54 NOR3.13
RESET_MAINFAULT  (via drill 0.51)
  Top 0.203: R38.2 81.28,60.96 v77.62,57.3 76.81,57.3 76.71,57.2 75.51,57.2 NOR4.12 | v57.1,53.29 55.47,53.29 NOR2.6 | NOR2.12 62.59,57.15 v63.2,57.76 64.21,58.78 64.21,61.11 60.3,65.02 v59.33,65.02 | v73.76,42.47 74.37,41.86 75.39,41.86 NOR5.12 | v67.46,53.24 69.29,53.24 NOR4.6 | 29.67,58.12 30.07,58.52 30.89,58.52 NOR3.12 | 29.67,58.12 28.65,57.1 28.65,56.29 26.82,54.46 26.42,54.46 26.21,54.66 24.99,54.66 NOR3.6 | v40.84,68.48 42.47,68.48 NOR1.6 | v50.6,72.54 48.97,72.54 NOR1.12 | v29.26,58.52 29.67,58.12
  Bottom 0.203: v57.1,53.29 58.73,53.29 62.99,57.56 | 64.62,53.24 64.62,55.93 62.99,57.56 | 64.62,53.24 64.62,49.78 60.96,46.13 60.96,44.37 62.87,42.47 v73.76,42.47 | 62.99,57.56 v63.2,57.76 | 64.62,53.24 v67.46,53.24 71.53,57.3 v77.62,57.3 | v40.84,68.48 40.84,69.7 41.66,70.51 41.66,71.32 | 41.66,71.32 37.59,75.39 33.73,75.39 | 33.73,75.39 30.89,75.39 24.99,81.28 24.99,92.05 22.96,94.08 INPUT.11 | 41.66,71.32 42.88,72.54 v50.6,72.54 58.12,65.02 v59.33,65.02 | v29.26,58.52 29.26,63.12 33.73,67.59 33.73,75.39
SCU_CONTROL
  Top 0.203: R40.2 90.49,45.11 | 90.49,45.11 AND1.1 | 90.49,45.11 92.05,45.11 98.02,51.08 98.02,95.22 96.5,96.75 29.08,96.75 27.23,94.89 27.23,94.28 INPUT.10
SET_AUX1
  Top 0.203: AUX1.2 R17.2 38.42,33.02 68.38,33.02 72.14,36.78 72.14,46.56 75.59,50.01 75.59,52.02 NOR4.8
SET_BMSFAULT
  Top 0.203: BMS.2 25.4,33.33 | 25.4,33.33 23.98,33.33 20.73,36.58 20.73,41.4 21.59,42.27 21.59,58.37 23.16,59.94 23.37,59.94 23.57,59.74 24.79,59.74 NOR3.2 | 25.4,33.33 R11.2
SET_BSPDFAULT  (via drill 0.51)
  Top 0.203: BSPD.2 R4.2 | v15.44,77.01 17.07,78.64 37.39,78.64 40.23,75.79 40.23,75.39 40.44,75.18 40.44,74.98 41.66,73.76 42.47,73.76 NOR1.2
  Bottom 0.203: v15.44,77.01 5.84,67.41 5.84,19.56 8.33,17.07 9.55,17.07 11.38,18.9 BSPD.2
SET_BSPDPLAUS1  (via drill 0.51)
  Top 0.203: BSPDPLAUS1.2 R5.2 11.58,33.33 12.8,33.33 17.17,37.69 17.17,40.28 20.75,43.87 20.75,58.75 v24.18,62.18 | v42.67,62.18 43.08,62.59 44.7,62.59 48.77,66.65 48.77,67.26 NOR1.8
  Bottom 0.203: v42.67,62.18 34.14,62.18 29.67,57.71 28.65,57.71 v24.18,62.18
SET_BSPDPLAUS2  (via drill 0.51)
  Top 0.203: BSPDPLAUS2.2 R6.2 | v51,60.76 53.19,58.57 55.27,58.57 NOR2.2 | v34.75,57.1 34.14,56.49 34.14,55.07 34.54,54.66 35.56,54.66 35.76,54.46 37.39,54.46 38.33,55.4 v38.73,55.4
  Bottom 0.203: v51,60.76 51,58.12 47.35,54.46 46.53,54.46 45.72,55.27 45.72,57.3 45.11,57.91 35.56,57.91 v34.75,57.1 | v38.73,55.4 38.73,55.19 24.13,40.59 24.13,27.15 23.44,26.47 21.89,26.47 11.58,36.78 11.58,39.22 BSPDPLAUS2.2
SET_FUSEFAULT  (via drill 0.51)
  Top 0.203: R16.2 FUSE.2 | v63.8,54.25 63.8,54.86 67.46,58.52 69.29,58.52 NOR4.2
  Bottom 0.203: v63.8,54.25 63.8,49.58 53.37,39.14 53.37,21.87 44.5,13.01 33.33,13.01 32.72,13.61 32.72,14.43 34.52,16.23 36.45,16.23 38,17.78 38,18.9 FUSE.2
SET_IMDFAULT
  Top 0.203: IMD.2 25.4,23.16 | 25.4,23.16 26.82,23.16 29.87,26.21 29.87,30.07 36.78,36.98 42.75,36.98 45.97,33.76 58.17,33.76 58.65,34.24 58.65,35.03 58.24,35.43 58.24,46.56 61.57,49.89 61.57,52.07 NOR2.8 | 25.4,23.16 R10.2
SET_MAINFAULT
  Top 0.203: 83.31,55.27 82.91,55.68 82.91,57.1 R37.2 | 83.31,55.27 83.52,55.07 83.72,55.07 84.94,53.85 84.94,51.82 84.73,51.61 84.73,51 BUF4.4 | 83.31,55.27 83.11,55.07 82.09,55.07 72.95,45.92 72.95,37.39 73.56,36.78 75.39,36.78 NOR5.8
SET_TEMPFAULT
  Top 0.203: 25.4,43.48 TEMP.2 | 25.4,43.48 26.82,43.48 31.09,47.75 31.09,53.24 NOR3.8 | 25.4,43.48 R12.2
TEMPFAULT
  Top 0.203: INPUT.6 18.71,88.24 R46.1 13.82,83.31 12.19,83.31 2.16,73.28 2.16,3.89 4.17,1.88 50.85,1.88 58.32,9.35 58.52,9.35 59.54,10.36 60.96,10.36 61.37,10.77 61.37,10.97 61.77,11.38 R9.1
TEMPFAULT_B  (via drill 0.51)
  Top 0.203: v29.26,72.34 30.89,72.34 BUF1.12 | v22.76,57.51 22.12,56.87 22.12,41.68 22.35,41.45 22.35,41.25 22.76,40.84 22.76,39.42 TEMP.1
  Bottom 0.203: v29.26,72.34 29.08,72.34 22.76,66.02 v22.76,57.51
TEMPFAULT_LED  (via drill 0.51)
  Top 0.203: OUTPUT.6 75.71,92.03 76.25,91.49 78.18,91.49 79.12,90.55 79.12,88.2 R24.2 83.92,83.52 87.99,83.52 96.32,75.18 v96.32,54.25 | v57.38,34.72 57.38,38 55.47,38 BUF3.6 | v64.21,11.99 64.62,11.58 65.43,11.58 65.84,11.18 66.45,11.18 66.65,11.38 OR2.2
  Bottom 0.203: v57.38,34.72 57.38,18.82 v64.21,11.99 64.21,7.32 67.94,3.58 76.71,3.58 96.32,23.19 v96.32,54.25
VCC  (via drill 0.51)
  Top 0.203: NOT1.5 83.11,41.05 80.87,41.05 77.22,44.7 76.81,44.7 76.4,44.3 75.59,44.3 NOR5.14
  Top 0.61: v76.2,60.96 76.2,60.43 NOR4.14 | v61.59,60.96 61.49,60.96 NOR2.14 | v44.45,80.01 R47.2 R41.2 R48.2 35.56,81.6 | 35.56,81.6 R42.2 R43.2 | R46.2 R45.2 R44.2 24.81,81.6 v26.04,82.83 | v49.53,76.3 49.53,75.67 NOR1.14 | v31.22,76.35 31.22,75.13 BUF1.14 | v48.79,62.43 BUF2.14 | v31.01,62.33 NOR3.14 | v75.49,45.7 75.49,44.48 NOR5.14 | v61.77,45.7 61.77,44.73 BUF3.14 | v73.2,13.97 73.2,12.98 OR2.14 | v33.58,13.97 33.58,12.72 OR1.14 | v82.86,53.34 82.87,53.33 BUF4.5 | v90.4,53.06 90.4,50.92 AND1.5 | 35.56,81.6 34.95,82.21 v34.95,85.3
  Bottom 0.61: X1.1 80.01,69.85 | 80.01,69.85 77.47,69.85 76.2,68.58 | 76.2,68.58 v76.2,60.96 | 76.2,68.58 64.77,68.58 | 64.77,68.58 64.19,68.58 61.95,66.34 61.95,66.04 | v61.59,60.96 61.95,61.32 61.95,66.04 | 64.77,68.58 55.12,78.23 49.53,78.23 | 49.53,78.23 46.23,78.23 v44.45,80.01 32.89,80.01 31.22,78.33 v31.22,76.35 | 49.53,78.23 v49.53,76.3 | 61.95,66.04 58.34,62.43 52.07,62.43 | 52.07,62.43 v48.79,62.43 44.58,62.43 43,64.01 32.69,64.01 v31.01,62.33 | 80.01,69.85 80.01,53.34 | 80.01,53.34 80.01,50.22 79.67,49.87 | 79.67,49.87 v75.49,45.7 v61.77,45.7 | 79.67,49.87 79.67,20.43 v73.2,13.97 | 52.07,62.43 52.07,22.86 43.18,13.97 v33.58,13.97 | 80.01,53.34 v82.86,53.34 90.4,53.34 v90.4,53.06 | v34.95,85.3 34.41,85.3 31.95,82.83 v26.04,82.83
~Q
  Top 0.203: NOR5.10 75.59,39.42 75.59,40.64 NOR5.11
~Q_AUX1
  Top 0.203: NOR4.10 75.59,54.66 75.59,55.88 NOR4.11
~Q_BMSFAULT
  Top 0.203: NOR3.5 26.82,55.88 27.23,56.29 27.23,60.55 26.62,61.16 26.21,61.16 25.81,60.76 25.2,60.76 24.99,60.96 NOR3.1
~Q_BSPDFAULT
  Top 0.203: NOR1.5 42.67,69.9 43.28,69.9 44.91,71.53 44.91,74.57 44.3,75.18 44.09,75.18 43.69,74.78 42.67,74.78 NOR1.1
~Q_BSPDPLAUS1
  Top 0.203: NOR1.10 48.97,69.9 48.97,71.12 NOR1.11
~Q_BSPDPLAUS2
  Top 0.203: NOR2.5 55.47,54.71 56.29,54.71 57.71,56.13 57.71,59.18 57.1,59.79 55.47,59.79 NOR2.1
~Q_FUSEFAULT
  Top 0.203: NOR4.5 69.49,54.66 69.9,54.66 71.12,55.88 71.32,55.88 71.73,56.29 71.73,59.33 71.12,59.94 70.71,59.94 70.31,59.54 69.49,59.54 NOR4.1
~Q_IMDFAULT
  Top 0.203: NOR2.10 61.57,54.71 61.57,55.73 NOR2.11
~Q_TEMPFAULT
  Top 0.203: NOR3.10 31.09,55.88 31.09,57.1 NOR3.11

### Text on the board
tNames: Outputs: | 7. FUSELED / 8. AUX1LED / 9. AUX2LED / 10. AIR Control | 1. BSPDLED / 2. BSPDPLAUS1LED / 3. BSPDPLAUS2LED / 4. IMDLED / 5. BMSLED / 6. TEMPLED | Inputs: | 7. FUSEFAULT / 8. AUX1 / 9. AUX2 / 10. SCU control signal / 11. Reset main fault | 1. BSPDFAULT / 2. BSPDPLAUS1 / 3. BSPDPLAUS2 / 4. IMDFAULT / 5. BMSFAULT / 6. TEMPFAULT | Shutdown Circuit (SC) Board / Rev D: May 5th, 2019 | Author: github.com/michaelpass
tValues: INPUT | POWER | OUTPUT | GND | VCC